# Altium project NTC_Extension_6Fach.PrjPcb
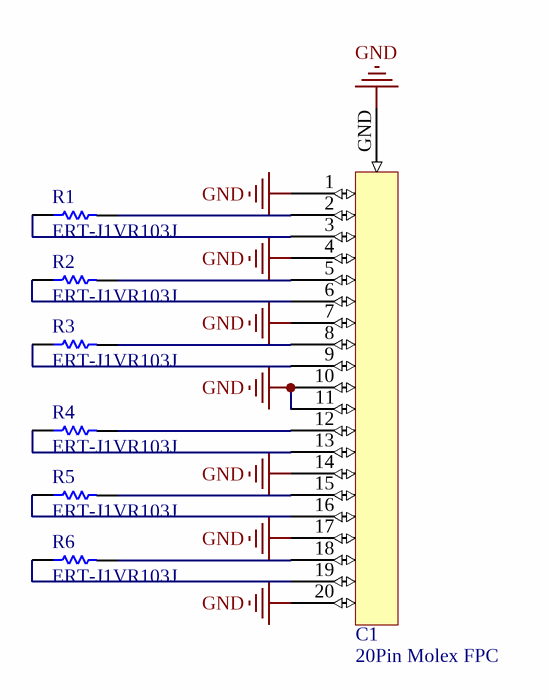
[diagram p0: Main_NTC_Extension_6Fach.SchDoc]
1 sheet, 7 parts. Net scope: global (net labels, ports and power ports of the same name join across sheets).
Board file: NTC_Extension_6Fach.PcbDoc

## Sheet Main_NTC_Extension_6Fach.SchDoc: Sheetname
size A4; Date: 05.10.2017; CheckedBy: UNCHECKED; Author: Team Member; Organization: Baltic Racing; Address1: Zur Schwedenschanze 15; Address2: Haus 18; Address3: 18435 Stralsund; Revision: xx.xx; SheetNumber: 1; SheetTotal: 1; Rules: TODO; ProjectName: Projekt

### Parts
C1  20Pin Molex FPC  [Molex 20 Pin FPC]
R1  ERT-J1VR103J  [RESC1608X90X30ML15T20]
R2  ERT-J1VR103J  [RESC1608X90X30ML15T20]
R3  ERT-J1VR103J  [RESC1608X90X30ML15T20]
R4  ERT-J1VR103J  [RESC1608X90X30ML15T20]
R5  ERT-J1VR103J  [RESC1608X90X30ML15T20]
R6  ERT-J1VR103J  [RESC1608X90X30ML15T20]

### Nets
GND: C1.1 C1.4 C1.7 C1.10 C1.11 C1.14 C1.17 C1.20 C1.GND
NetC1_2: C1.2 R1.2
NetC1_3: C1.3 R1.1
NetC1_5: C1.5 R2.2
NetC1_6: C1.6 R2.1
NetC1_8: C1.8 R3.2
NetC1_9: C1.9 R3.1
NetC1_12: C1.12 R4.2
NetC1_13: C1.13 R4.1
NetC1_15: C1.15 R5.2
NetC1_16: C1.16 R5.1
NetC1_18: C1.18 R6.2
NetC1_19: C1.19 R6.1

### Notes on the sheet
- Title:
- Projekt:
- Revision:
- Author:
- Rules:
- Checked by:
- Sheet
- of
- Size:
- A4
- Date:
- Time:

### Library data of the parts
C1 = 20Pin Molex FPC: Flex PCB part for the Molex 20pin FCC
R1-R6 = CMP-2000-00869-1: Manufacturer: Panasonic; Part Number: ERT-J1VR103J